# Altium schematic sheet 8-LEDx8.SchDoc
size A4
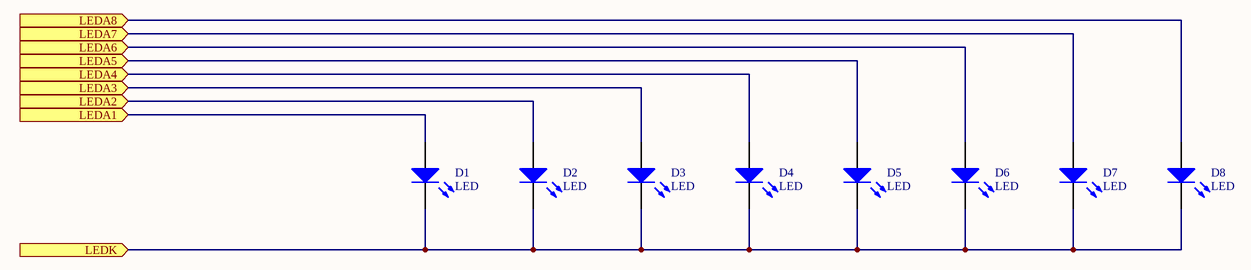
[diagram p0: 8-LEDx8.SchDoc]

## Parts
D1  LED  [LED-3mm]
D2  LED  [LED-3mm]
D3  LED  [LED-3mm]
D4  LED  [LED-3mm]
D5  LED  [LED-3mm]
D6  LED  [LED-3mm]
D7  LED  [LED-3mm]
D8  LED  [LED-3mm]

## Ports
LEDA1 (in), LEDA2 (in), LEDA3 (in), LEDA4 (in), LEDA5 (in), LEDA6 (in), LEDA7 (in), LEDA8 (in), LEDK (in)

## Nets
LEDA1: D1.1(A) ; port LEDA1
LEDA2: D2.1(A) ; port LEDA2
LEDA3: D3.1(A) ; port LEDA3
LEDA4: D4.1(A) ; port LEDA4
LEDA5: D5.1(A) ; port LEDA5
LEDA6: D6.1(A) ; port LEDA6
LEDA7: D7.1(A) ; port LEDA7
LEDA8: D8.1(A) ; port LEDA8
LEDK: D1.2(K) D2.2(K) D3.2(K) D4.2(K) D5.2(K) D6.2(K) D7.2(K) D8.2(K) ; port LEDK

## Library data of the parts
D1-D8 = LED0: Diffused Green 3mm LED; Fabricant: CREE; Fournisseur: Farnell; RefFabricant: C503B-BCN-CV0Z0462; RefFournisseur: 2414443